# EAGLE design prechodka (EAGLE 7.2.0)
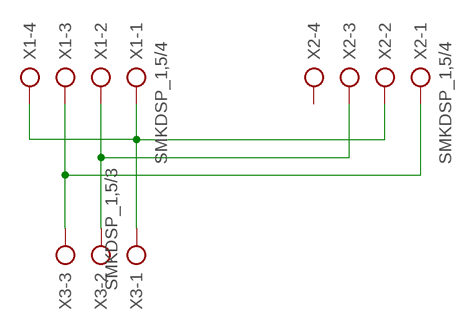
[diagram p0: schematic, sheet 1]

## Parts
X1  SMKDSP_1,5/4  [SMKDSP_1,5/4]
X2  SMKDSP_1,5/4  [SMKDSP_1,5/4]
X3  SMKDSP_1,5/3  [SMKDSP_1,5/3]

## Nets
BASE: X1.1 X1.4 X2.2 X3.1
COLECTOR: X1.2 X2.3 X3.2
EMITOR: X1.3 X2.1 X3.3
Unconnected: X2.4

## Library data of the parts
X1 X2 = con-phoenix-smkdsp:SMKDSP_1,5/4: Printklemme, Nennstrom: 17,5 A, Bemessungsspannung: 250 V, Raster: 5,0 mm Source: http://eshop.phoenixcontact.de .. 1733415.pdf; MF: FARNELL; MPN: 1733596; OC_FARNELL: 3041268; OC_NEWARK: 71C4131
X3 = con-phoenix-smkdsp:SMKDSP_1,5/3: Printklemme, Nennstrom: 17,5 A, Bemessungsspannung: 250 V, Raster: 5,0 mm Source: http://eshop.phoenixcontact.de .. 1733415.pdf; MF: FARNELL; MPN: 1733583; OC_FARNELL: 3041256; OC_NEWARK: 71C4130

## Board
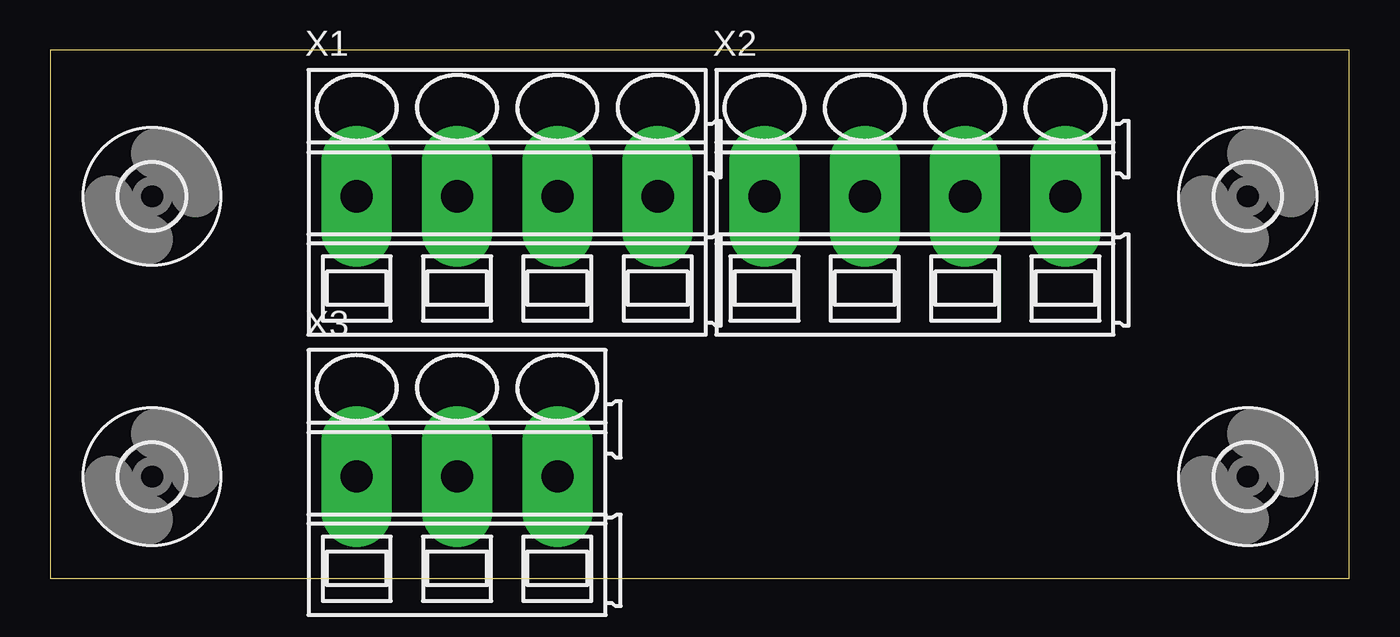
[diagram p1: board, top side]
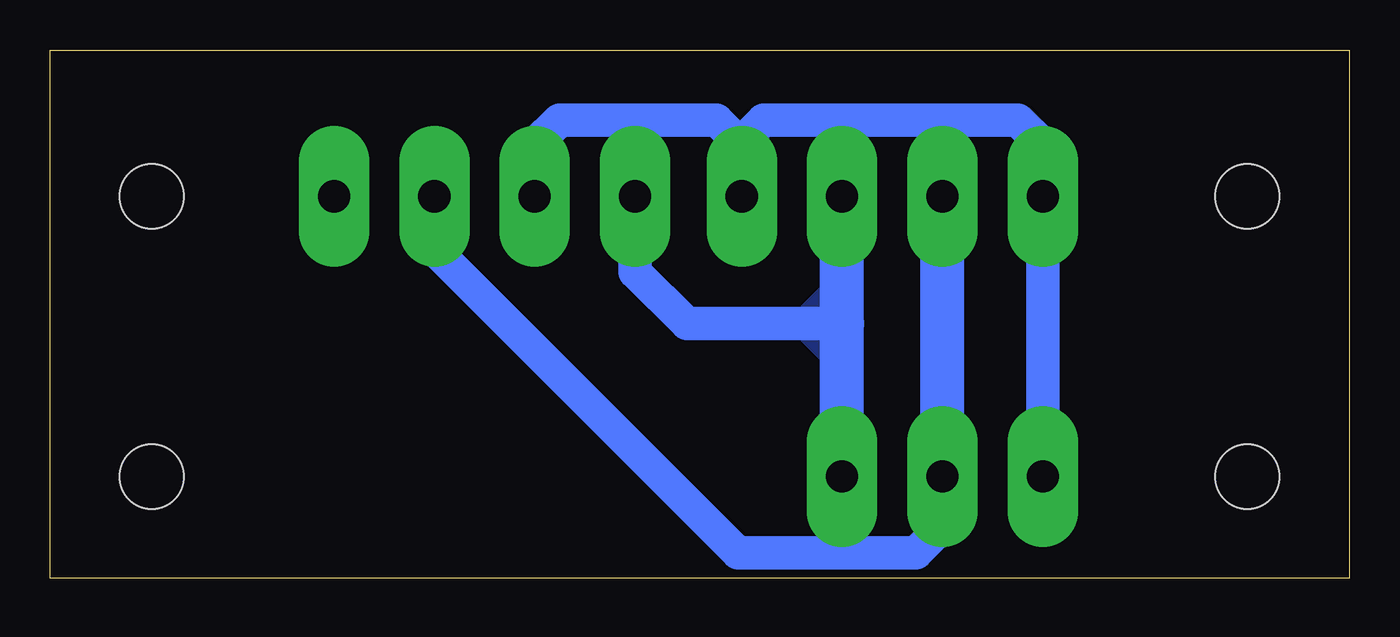
[diagram p2: board, bottom side, seen from below]

Size 64.75 x 26.34 mm. Coordinates in mm from the lower left corner, seen from the top.
Outline: 0,0 64.75,0 64.75,26.34 0,26.34 0,0
Copper layers (1*16): Top 0.035mm / dielectric 1.5mm / Bottom 0.035mm
Design rules "default *": minimum track width 10mil, minimum drill 24mil, track to track 8mil, track to pad 8mil, pad to pad 8mil, via to via 8mil, smd to smd 8mil, copper to edge 40mil, drill to drill 8mil, minimum pad ring 10mil, minimum via ring 8mil, stop-mask expansion 4mil, vias tented up to drill 0mil, thermal gap 10mil

### Footprints (pad centres in the part's own frame; a part is rotated, then mirrored left to right if it is on the bottom)
3,2 = hole 3.2: 0,0
SMKDSP_1,5/4 = drill 1.6 pad 1.8 long: 1 -2.5,0; 2 2.5,0; 3 7.5,0; 4 12.5,0
SMKDSP_1,5/3 = drill 1.6 pad 1.8 long: 1 -2.5,0; 2 2.5,0; 3 7.5,0

### Placement (x,y rotation side)
U$1  [3,2]  5.08,19.05 0 top
U$2  [3,2]  5.08,5.08 0 top
U$3  [3,2]  59.69,5.08 0 top
U$4  [3,2]  59.69,19.05 0 top
X1  17.78,19.05 0 top
X2  38.1,19.05 0 top
X3  17.78,5.08 0 top

### Tracks (layer width: path | path; a pad name or v marks a point on that pad's centre or on a via)
BASE
  Bottom 1.676: X3.1 X1.1 15.28,21.63 16.51,22.86 29.21,22.86 30.28,21.79 30.28,21.59 | X1.4 30.28,21.59 | X2.2 40.6,21.63 39.37,22.86 31.55,22.86 30.28,21.59
COLECTOR
  Bottom 1.676: 20.28,19.01 20.32,19.05 X1.2 | X2.3 45.6,16.39 30.48,1.27 21.59,1.27 20.32,2.54 20.32,5.04 X3.2
  Bottom 2.184: X3.2 20.28,19.01
EMITOR
  Bottom 1.676: X2.1 35.6,15.28 33.02,12.7 25.28,12.7
  Bottom 2.184: X3.3 25.28,12.7 X1.3
  pour Bottom: 27.94,12.7 25.4,10.16 25.4,15.24